# EAGLE design INA260_SFS (EAGLE 9.5.0)

## Sheet 1 of 4
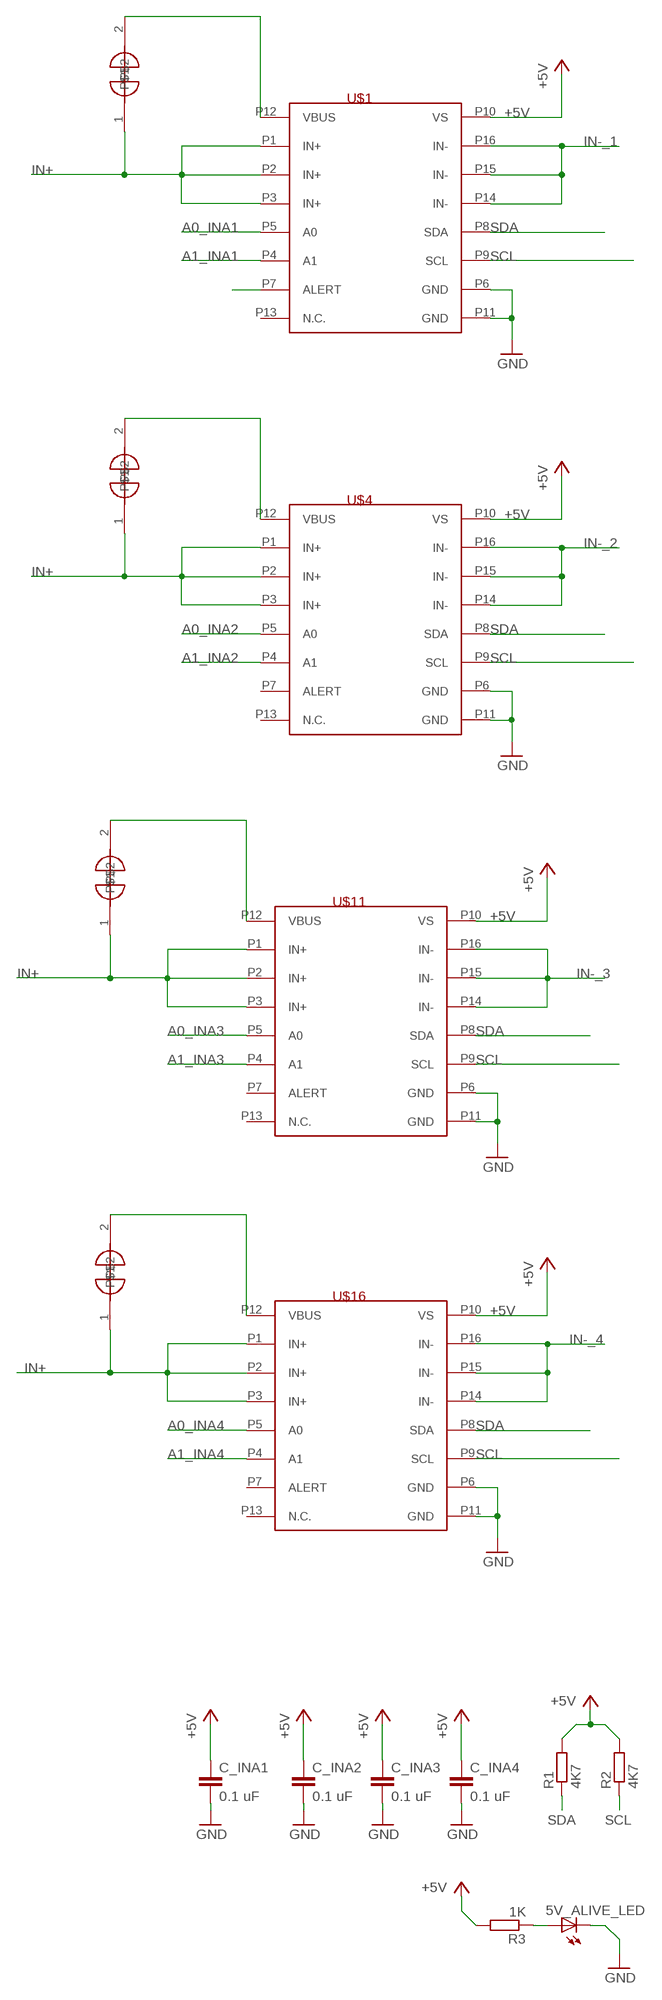
[diagram p0: schematic, sheet 1]

### Parts
5V_ALIVE_LED  LEDSMT1206  [1206]
C_INA1  0.1 uF  CAPACITOR_0805_N  [RESC0805_N]
C_INA2  0.1 uF  CAPACITOR_0805_N  [RESC0805_N]
C_INA3  0.1 uF  CAPACITOR_0805_N  [RESC0805_N]
C_INA4  0.1 uF  CAPACITOR_0805_N  [RESC0805_N]
R1  4K7  R-EU_M0805  [M0805]
R2  4K7  R-EU_M0805  [M0805]
R3  1K  R-EU_M0805  [M0805]
U$1  INA260  [TSSOP16L]
U$4  INA260  [TSSOP16L]
U$5  CLOSEDJUMPER  [SOLDERJUMPER_CLOSEDWIRE]
U$6  CLOSEDJUMPER  [SOLDERJUMPER_CLOSEDWIRE]
U$11  INA260  [TSSOP16L]
U$12  CLOSEDJUMPER  [SOLDERJUMPER_CLOSEDWIRE]
U$16  INA260  [TSSOP16L]
U$17  CLOSEDJUMPER  [SOLDERJUMPER_CLOSEDWIRE]

### Nets
+5V: C_INA1.1 C_INA2.1 C_INA3.1 C_INA4.1 R1.2 R2.2 R3.2 U$1.P10(VS) U$4.P10(VS) U$11.P10(VS) U$16.P10(VS) ; also sheet 2,4
A0_INA1: U$1.P5(A0) ; also sheet 2
A0_INA2: U$4.P5(A0) ; also sheet 2
A0_INA3: U$11.P5(A0) ; also sheet 2
A0_INA4: U$16.P5(A0) ; also sheet 2
A1_INA1: U$1.P4(A1) ; also sheet 2
A1_INA2: U$4.P4(A1) ; also sheet 2
A1_INA3: U$11.P4(A1) ; also sheet 2
A1_INA4: U$16.P4(A1) ; also sheet 2
GND: 5V_ALIVE_LED.C C_INA1.2 C_INA2.2 C_INA3.2 C_INA4.2 U$1.P6(GND) U$1.P11(GND) U$4.P6(GND) U$4.P11(GND) U$11.P6(GND) U$11.P11(GND) U$16.P6(GND) U$16.P11(GND) ; also sheet 2,3,4
IN+: U$1.P1(IN+) U$1.P2(IN+) U$1.P3(IN+) U$4.P1(IN+) U$4.P2(IN+) U$4.P3(IN+) U$5.1 U$6.1 U$11.P1(IN+) U$11.P2(IN+) U$11.P3(IN+) U$12.1 U$16.P1(IN+) U$16.P2(IN+) U$16.P3(IN+) U$17.1 ; also sheet 3,4
IN-_1: U$1.P14(IN-) U$1.P15(IN-) U$1.P16(IN-) ; also sheet 3
IN-_2: U$4.P14(IN-) U$4.P15(IN-) U$4.P16(IN-) ; also sheet 3
IN-_3: U$11.P14(IN-) U$11.P15(IN-) U$11.P16(IN-) ; also sheet 3
IN-_4: U$16.P14(IN-) U$16.P15(IN-) U$16.P16(IN-) ; also sheet 3
N$1: U$1.P12(VBUS) U$6.2
N$2: 5V_ALIVE_LED.A R3.1
N$9: U$4.P12(VBUS) U$5.2
N$11: U$1.P7(ALERT)
N$17: U$11.P12(VBUS) U$12.2
N$28: U$16.P12(VBUS) U$17.2
SCL: R2.1 U$1.P9(SCL) U$4.P9(SCL) U$11.P9(SCL) U$16.P9(SCL) ; also sheet 2,3
SDA: R1.1 U$1.P8(SDA) U$4.P8(SDA) U$11.P8(SDA) U$16.P8(SDA) ; also sheet 2,3
Unconnected: U$1.P13(N.C.) U$4.P7(ALERT) U$4.P13(N.C.) U$11.P7(ALERT) U$11.P13(N.C.) U$16.P7(ALERT) U$16.P13(N.C.)

## Sheet 2 of 4
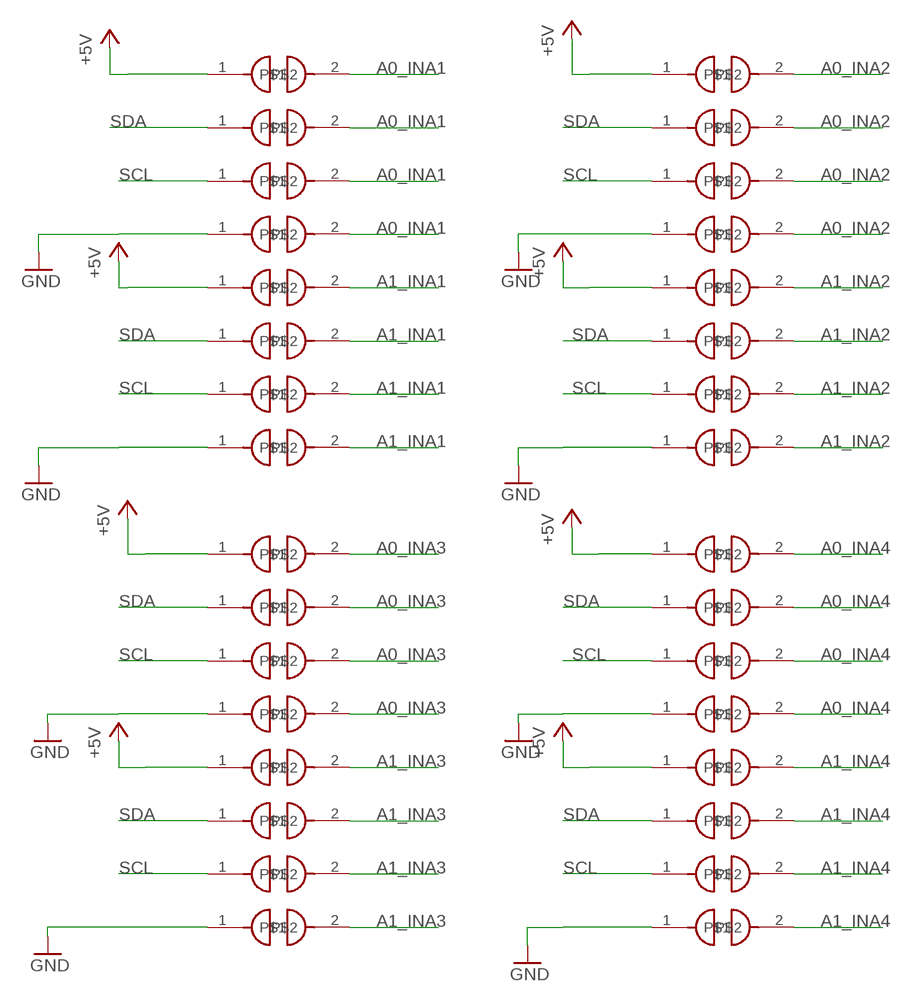
[diagram p1: schematic, sheet 2]

### Parts
U$38  JUMPER  [SOLDERJUMPER_ARROW_NOPASTE]
U$39  JUMPER  [SOLDERJUMPER_ARROW_NOPASTE]
U$40  JUMPER  [SOLDERJUMPER_ARROW_NOPASTE]
U$41  JUMPER  [SOLDERJUMPER_ARROW_NOPASTE]
U$42  JUMPER  [SOLDERJUMPER_ARROW_NOPASTE]
U$43  JUMPER  [SOLDERJUMPER_ARROW_NOPASTE]
U$44  JUMPER  [SOLDERJUMPER_ARROW_NOPASTE]
U$45  JUMPER  [SOLDERJUMPER_ARROW_NOPASTE]
U$46  JUMPER  [SOLDERJUMPER_ARROW_NOPASTE]
U$47  JUMPER  [SOLDERJUMPER_ARROW_NOPASTE]
U$48  JUMPER  [SOLDERJUMPER_ARROW_NOPASTE]
U$49  JUMPER  [SOLDERJUMPER_ARROW_NOPASTE]
U$50  JUMPER  [SOLDERJUMPER_ARROW_NOPASTE]
U$51  JUMPER  [SOLDERJUMPER_ARROW_NOPASTE]
U$52  JUMPER  [SOLDERJUMPER_ARROW_NOPASTE]
U$53  JUMPER  [SOLDERJUMPER_ARROW_NOPASTE]
U$54  JUMPER  [SOLDERJUMPER_ARROW_NOPASTE]
U$55  JUMPER  [SOLDERJUMPER_ARROW_NOPASTE]
U$56  JUMPER  [SOLDERJUMPER_ARROW_NOPASTE]
U$57  JUMPER  [SOLDERJUMPER_ARROW_NOPASTE]
U$58  JUMPER  [SOLDERJUMPER_ARROW_NOPASTE]
U$59  JUMPER  [SOLDERJUMPER_ARROW_NOPASTE]
U$60  JUMPER  [SOLDERJUMPER_ARROW_NOPASTE]
U$61  JUMPER  [SOLDERJUMPER_ARROW_NOPASTE]
U$62  JUMPER  [SOLDERJUMPER_ARROW_NOPASTE]
U$63  JUMPER  [SOLDERJUMPER_ARROW_NOPASTE]
U$64  JUMPER  [SOLDERJUMPER_ARROW_NOPASTE]
U$65  JUMPER  [SOLDERJUMPER_ARROW_NOPASTE]
U$66  JUMPER  [SOLDERJUMPER_ARROW_NOPASTE]
U$67  JUMPER  [SOLDERJUMPER_ARROW_NOPASTE]
U$68  JUMPER  [SOLDERJUMPER_ARROW_NOPASTE]
U$69  JUMPER  [SOLDERJUMPER_ARROW_NOPASTE]

### Nets
+5V: U$41.1 U$45.1 U$49.1 U$53.1 U$57.1 U$61.1 U$65.1 U$69.1 ; also sheet 1,4
A0_INA1: U$42.2 U$43.2 U$44.2 U$45.2 ; also sheet 1
A0_INA2: U$50.2 U$51.2 U$52.2 U$53.2 ; also sheet 1
A0_INA3: U$58.2 U$59.2 U$60.2 U$61.2 ; also sheet 1
A0_INA4: U$66.2 U$67.2 U$68.2 U$69.2 ; also sheet 1
A1_INA1: U$38.2 U$39.2 U$40.2 U$41.2 ; also sheet 1
A1_INA2: U$46.2 U$47.2 U$48.2 U$49.2 ; also sheet 1
A1_INA3: U$54.2 U$55.2 U$56.2 U$57.2 ; also sheet 1
A1_INA4: U$62.2 U$63.2 U$64.2 U$65.2 ; also sheet 1
GND: U$38.1 U$42.1 U$46.1 U$50.1 U$54.1 U$58.1 U$62.1 U$66.1 ; also sheet 1,3,4
SCL: U$39.1 U$43.1 U$47.1 U$51.1 U$55.1 U$59.1 U$63.1 U$67.1 ; also sheet 1,3
SDA: U$40.1 U$44.1 U$48.1 U$52.1 U$56.1 U$60.1 U$64.1 U$68.1 ; also sheet 1,3

## Sheet 3 of 4
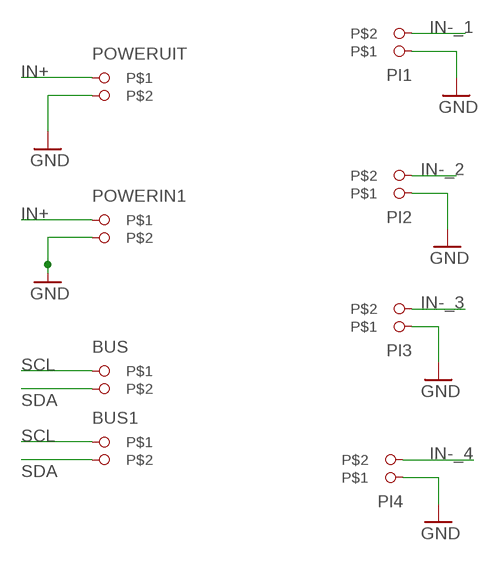
[diagram p2: schematic, sheet 3]

### Parts
BUS  CON_3.81MM2_SIDE  [CON_3.81MM2]
BUS1  CON_3.81MM2_SIDE  [CON_3.81MM2]
PI1  CON_3.81MM2_SIDE  [CON_3.81MM2]
PI2  CON_3.81MM2_SIDE  [CON_3.81MM2]
PI3  CON_3.81MM2_SIDE  [CON_3.81MM2]
PI4  CON_3.81MM2_SIDE  [CON_3.81MM2]
POWERIN1  CON_3.81MM2_SIDE  [CON_3.81MM2]
POWERUIT  CON_3.81MM2_SIDE  [CON_3.81MM2]

### Nets
GND: PI1.P$1 PI2.P$1 PI3.P$1 PI4.P$1 POWERIN1.P$2 POWERUIT.P$2 ; also sheet 1,2,4
IN+: POWERIN1.P$1 POWERUIT.P$1 ; also sheet 1,4
IN-_1: PI1.P$2 ; also sheet 1
IN-_2: PI2.P$2 ; also sheet 1
IN-_3: PI3.P$2 ; also sheet 1
IN-_4: PI4.P$2 ; also sheet 1
SCL: BUS1.P$1 BUS.P$1 ; also sheet 1,2
SDA: BUS1.P$2 BUS.P$2 ; also sheet 1,2

## Sheet 4 of 4
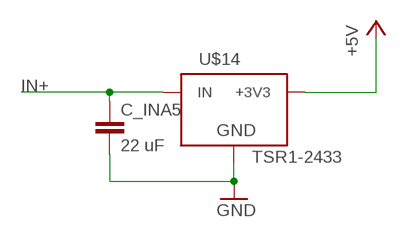
[diagram p3: schematic, sheet 4]

### Parts
C_INA5  22 uF  CAPACITOR_0805_N  [RESC0805_N]
U$14  TSR1-2433  [TSR-1]

### Nets
+5V: U$14.3(+3V3) ; also sheet 1,2
GND: C_INA5.2 U$14.2(GND) ; also sheet 1,2,3
IN+: C_INA5.1 U$14.1(IN) ; also sheet 1,3

## Library data of the parts
5V_ALIVE_LED = led:LED: LED OSRAM: - CHIPLED LG R971, LG N971, LY N971, LG Q971, LY Q971, LO R971, LY R971 LH N974, LH R974 LS Q976, LO Q976, LY Q976 LO Q996 - Hyper CHIPLED LW Q18S LB Q993, LB Q99A, LB R99A - SideLED LS A670, LO A670, LY A670, LG A670, LP A670 LB A673, LV A673, LT A673, LW A673 LH A674 LY A675 LS A676, LA A676, LO A676, LY A676, LW A676 LS A679, LY A679, LG A679 - Hyper Micro SIDELED® LS Y876, LA Y876, LO Y876, LY Y876 LT Y87S - SmartLED LW L88C, LW L88S LB L89C, LB L89S, LG L890 LS L89K, LO L89K, LY L89K LS L896, LA L896, LO L896, LY L896 - TOPLED LS T670, LO T670, LY T670, LG T670, LP T670 LSG T670, LSP T670, LSY T670, LOP T670, LYG T670 LG T671, LOG T671, LSG T671 LB T673, LV T673, LT T673, LW T673 LH T674 LS T676, LA T676, LO T676, LY T676, LB T676, LH T676, LSB T676, LW T676 LB T67C, LV T67C, LT T67C, LS T67K, LO T67K, LY T67K, LW E67C LS E67B, LA E67B, LO E67B, LY E67B, LB E67C, LV E67C, LT E67C LW T67C LS T679, LY T679, LG T679 LS T770, LO T770, LY T770, LG T770, LP T770 LB T773, LV T773, LT T773, LW T773 LH T774 LS E675, LA E675, LY E675, LS T675 LS T776, LA T776, LO T776, LY T776, LB T776 LHGB T686 LT T68C, LB T68C - Hyper Mini TOPLED® LB M676 - Mini TOPLED Santana® LG M470 LS M47K, LO M47K, LY M47K Source: http://www.osram.convergy.de LUXEON: - LUMILED® LXK2-PW12-R00, LXK2-PW12-S00, LXK2-PW14-U00, LXK2-PW14-V00 LXK2-PM12-R00, LXK2-PM12-S00, LXK2-PM14-U00 LXK2-PE12-Q00, LXK2-PE12-R00, LXK2-PE12-S00, LXK2-PE14-T00, LXK2-PE14-U00 LXK2-PB12-K00, LXK2-PB12-L00, LXK2-PB12-M00, LXK2-PB14-N00, LXK2-PB14-P00, LXK2-PB14-Q00 LXK2-PR12-L00, LXK2-PR12-M00, LXK2-PR14-Q00, LXK2-PR14-R00 LXK2-PD12-Q00, LXK2-PD12-R00, LXK2-PD12-S00 LXK2-PH12-R00, LXK2-PH12-S00 LXK2-PL12-P00, LXK2-PL12-Q00, LXK2-PL12-R00 Source: www.luxeon.com KINGBRIGHT: KA-3528ASYC Source: www.kingbright.com
BUS BUS1 PI1-PI4 POWERIN1 POWERUIT = Phoenix_connector_DJ:CON_3.81MM2_SIDE
C_INA1-C_INA5 = Nordic_misc:CAPACITOR: Generic chip capacitor
R1-R3 = rcl:R-EU_: RESISTOR, European symbol; SPICEPREFIX: R
U$1 U$4 U$11 U$16 = SFS:INA260
U$5 U$6 U$12 U$17 = SFS:CLOSEDJUMPER
U$14 = Traco power:TSR1-2433: Traco Power TSR 1-2433 3.3v switching regulator
U$38-U$69 = SFS:JUMPER

## Board
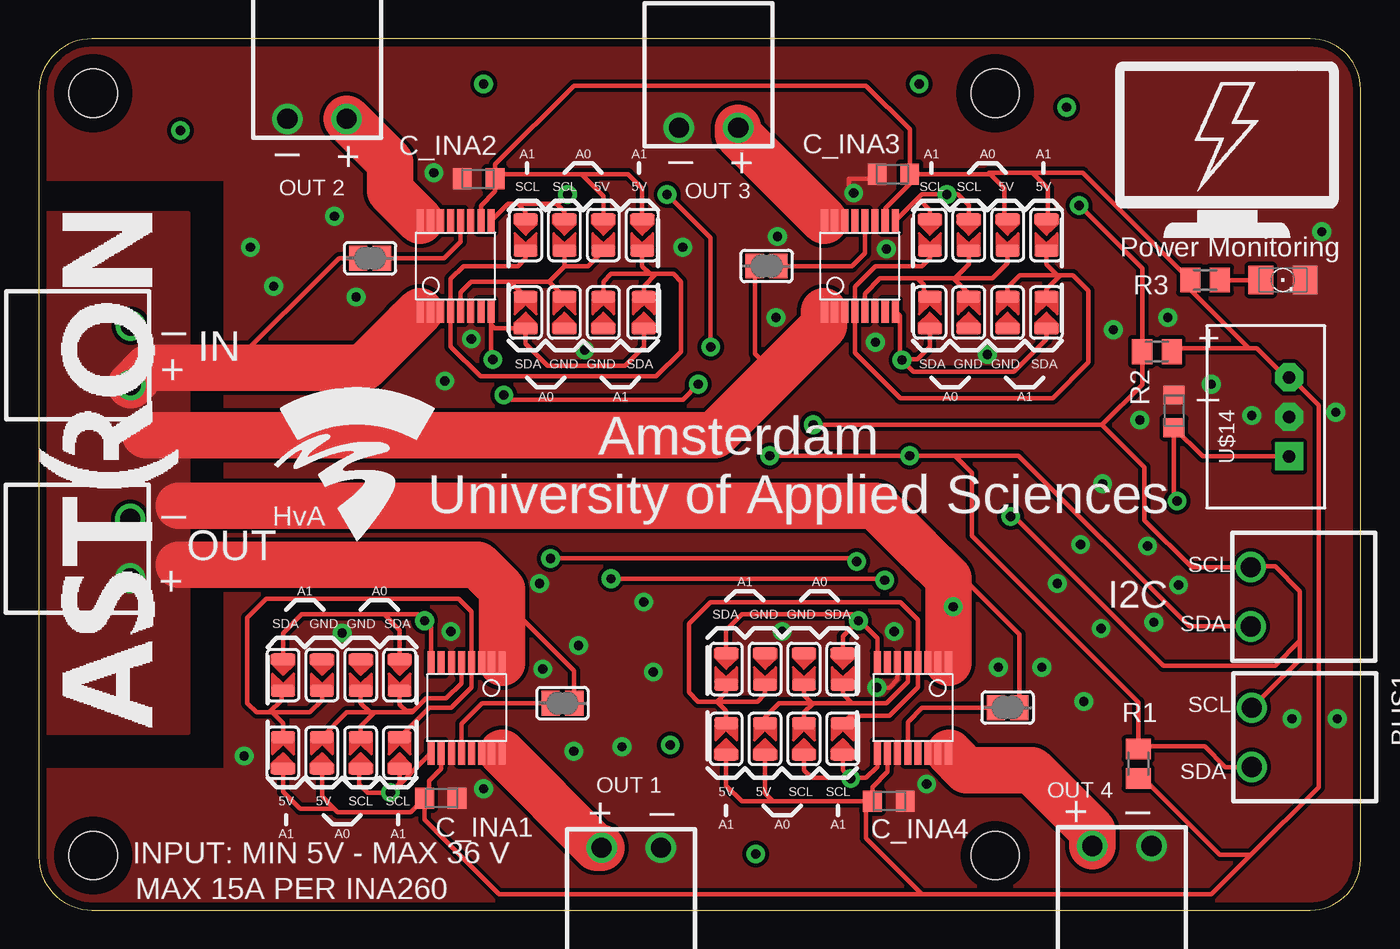
[diagram p4: board, top side]
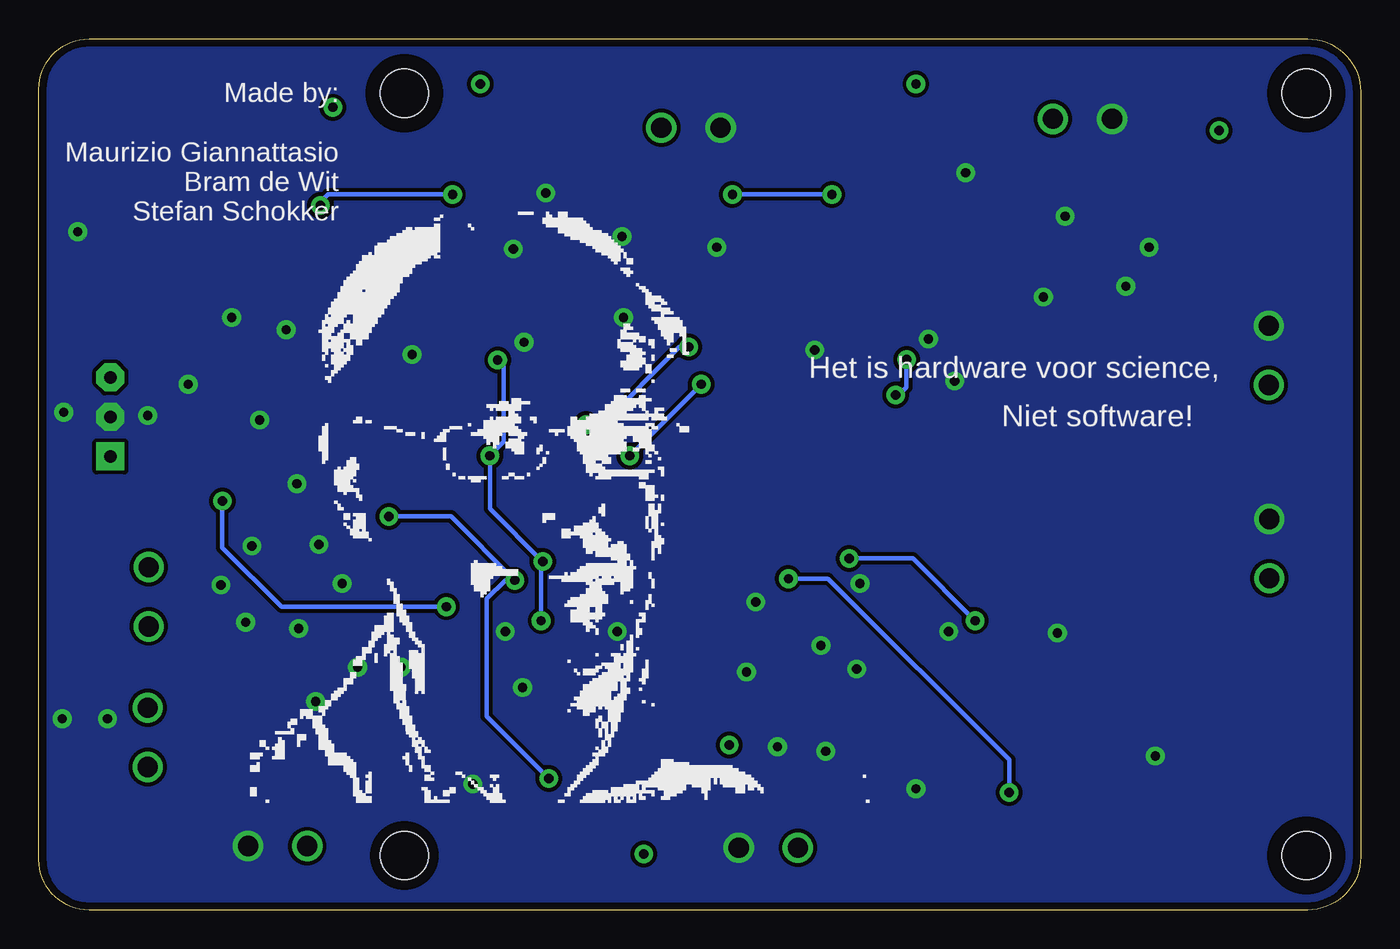
[diagram p5: board, bottom side, seen from below]

Size 85 x 56 mm. Coordinates in mm from the lower left corner, seen from the top.
Outline: 85,3.23 85,52.77 arc90 81.78,56 3.41,56 arc90 0,52.59 0,3.41 arc90 3.41,0 81.78,0 arc90 85,3.23
Copper layers (1*16): Top 0.035mm / dielectric 1.5mm / Bottom 0.035mm
Design rules "HVA-LPKF *": minimum track width 0.3mm, minimum drill 0.6mm, track to track 0.25mm, track to pad 0.25mm, pad to pad 0.25mm, via to via 0.25mm, smd to smd 0.25mm, copper to edge 0.5mm, drill to drill 0.5mm, minimum pad ring 0.3mm, minimum via ring 0.3mm, stop-mask expansion 0.1mm, vias tented up to drill 0mil, thermal gap 0.3mm
Holes 3.1 mm at 3.5,3.5 3.5,52.5 61.5,3.5 61.5,52.5
tRestrict: area 3,3 to 4,4; area 3,52 to 4,53; area 61,52 to 62,53; area 60.8,2.8 to 62.2,4.2
bRestrict: area 60.8,2.8 to 62.2,4.2; area 61,52 to 62,53; area 3,52 to 4,53; area 3,3 to 4,4

### Footprints (pad centres in the part's own frame; a part is rotated, then mirrored left to right if it is on the bottom)
1206 = smd 1.6 x 1.803: A -1.422,0; C 1.422,0
CON_3.81MM2 = drill 1.3: P$1 0,0; P$2 3.81,0
RESC0805_N = smd 1.2 x 1.35: 1 -1.1,0; 2 1,0
M0805 = smd 1.3 x 1.6: 1 -0.95,0; 2 0.95,0
TSSOP16L = smd 1.5 x 0.45: P1 -2.9,2.275; P2 -2.9,1.625; P3 -2.9,0.975; P4 -2.9,0.325; P5 -2.9,-0.325; P6 -2.9,-0.975; P7 -2.9,-1.625; P8 -2.9,-2.275; P9 2.9,-2.275; P10 2.9,-1.625; P11 2.9,-0.975; P12 2.9,-0.325; P13 2.9,0.325; P14 2.9,0.975; P15 2.9,1.625; P16 2.9,2.275
SOLDERJUMPER_CLOSEDWIRE = smd 1.168 x 1.6: 1 -0.762,0; 2 0.762,0 | smd 0.635 x 0.203: WIRE 0,0
TSR-1 = drill 0.8 pad 1.8 square: 1 -2.54,-1.5 | drill 0.8 pad 1.8 octagon: 2 0,-1.5; 3 2.54,-1.5
SOLDERJUMPER_ARROW_NOPASTE = smd 0.762 x 1.524: 1 -1.016,0; 2 1.016,0

### Placement (x,y rotation side)
5V_ALIVE_LED  80,40.5 0 top
BUS  77.94,22.04 270 top
BUS1  78,13 270 top
C_INA1  25.9,7.2 0 top
C_INA2  28.24,47 180 top
C_INA3  54.9,47.3 180 top
C_INA4  54.7,7 0 top
C_INA5  73,32.1 90 top
PI1  40,4 180 top
PI2  15.98,50.86 0 top
PI3  41.16,50.29 0 top
PI4  71.55,4.11 180 top
POWERIN1  5.91,33.75 90 top
POWERUIT  5.87,21.33 90 top
R1  70.7,9.4 270 top
R2  71.9,35.9 0 top
R3  75,40.5 180 top
U$1  27.5,13 270 top
U$2  [POWER_MONITORING_LOGO]  67.4,40.4 0 top
U$3  [JUMPER_INFO]  14.7,16.9 0 top
U$4  26.8,41.4 90 top
U$5  21.3,41.9 0 top
U$6  33.67,13.29 180 top
U$7  [JUMPER_INFO]  43,17.5 0 top
U$8  [JUMPER_INFO]  65.8,36.6 180 top
U$9  [JUMPER_INFO]  39.8,36.6 180 top
U$10  [HVA_LOGO]  14.5,22.5 0 top
U$11  52.8,41.4 90 top
U$12  46.8,41.4 0 top
U$13  [ASTRON_LOGO]  9,11.7 90 top
U$14  78.9,31.7 90 top
U$15  [ED_KLEIN]  71.5,7 0 bottom
U$16  56.2,13 270 top
U$17  62.3,13.01 180 top
U$38  18.2,15.1 270 top
U$39  23.2,10.1 90 top
U$40  15.7,15.1 270 top
U$41  15.7,10.1 90 top
U$42  20.7,15.1 270 top
U$43  20.7,10.1 90 top
U$44  23.2,15.1 270 top
U$45  18.2,10.1 90 top
U$46  36.3,38.4 90 top
U$47  31.3,43.4 270 top
U$48  38.9,38.4 90 top
U$49  38.8,43.4 270 top
U$50  33.8,38.4 90 top
U$51  33.8,43.4 270 top
U$52  31.3,38.4 90 top
U$53  36.3,43.4 270 top
U$54  62.3,38.4 90 top
U$55  57.3,43.4 270 top
U$56  64.8,38.4 90 top
U$57  64.8,43.4 270 top
U$58  59.8,38.4 90 top
U$59  59.8,43.4 270 top
U$60  57.3,38.4 90 top
U$61  62.3,43.4 270 top
U$62  46.7,15.5 270 top
U$63  51.7,11 90 top
U$64  44.2,15.5 270 top
U$65  44.2,11 90 top
U$66  49.2,15.5 270 top
U$67  49.2,11 90 top
U$68  51.7,15.5 270 top
U$69  46.7,11 90 top

### Tracks (layer width: path | path; a pad name or v marks a point on that pad's centre or on a via)
+5V
  Top 0.3: U$4.P10 28.43,45.28 29.34,46.2 C_INA2.1 | 34.9,47.3 29.64,47.3 C_INA2.1 | 34.9,47.3 36.3,45.9 U$53.1 | 34.9,47.3 37.9,47.3 38.8,46.4 U$49.1 | U$11.P10 54.42,45.12 56,46.7 C_INA3.1 | 63.9,47.4 64.9,46.4 64.9,43.8 64.8,43.9 U$57.1 | C_INA3.1 61.2,47.3 | 63.9,47.4 61.1,47.4 61.2,47.3 | U$61.1 62.1,44.62 62.1,46.4 61.2,47.3 | U$1.P10 25.88,9.07 25.1,8.3 25.1,7.5 C_INA1.1 | C_INA1.1 23.9,6.3 19.2,6.3 19,6.5 | 19,6.5 16.8,6.5 15.7,7.6 U$41.1 | U$45.1 18.2,7.3 19,6.5 | U$16.P10 54.58,8.88 53.6,7.9 53.6,7.4 | 53.6,7.4 C_INA4.1 47.2,7 | 47.2,7 45.2,7 44.2,8 U$65.1 | U$69.1 46.7,7.5 47.2,7 | 63.9,47.4 67.15,47.4 R3.2 74.05,39.88 77.82,36.12 | C_INA2.1 29.34,47.94 34.4,53 53.2,53 56,50.2 C_INA3.1 | 56.8,1 53.2,4.6 53.2,7 53.6,7.4 | 77.95,3.55 82.3,7.9 82.3,32.44 80.5,34.24 U$14.3 80.19,34.24 78.32,36.12 77.82,36.12 | 77.95,3.55 75.4,1 56.8,1 | 56.8,1 29.6,1 24.8,5.8 C_INA1.1 | 77.82,36.12 73.07,36.12 R2.2 | 77.95,3.55 75.95,3.55 71.05,8.45 R1.2
A0_INA1
  Top 0.3: U$43.2 20.7,11.8 21.6,12.7 | U$1.P5 27.18,14.57 26.2,13.6 24.9,13.6 24.1,12.8 | U$45.2 19.78,12.7 21.3,12.7 | U$42.2 20.7,13.3 21.3,12.7 | 21.3,12.7 21.6,12.7 | U$44.2 23.2,13.2 23.6,12.8 24.1,12.8 | 24.1,12.8 24,12.7 21.6,12.7
A0_INA2
  Top 0.3: U$4.P5 27.12,39.73 27.8,40.4 30.3,40.4 | 32.8,40.4 33.8,41.4 | 33.8,41.4 U$51.2 | 30.3,40.4 32.8,40.4 | U$53.2 35.32,41.4 33.8,41.4 | U$50.2 33.78,39.42 32.8,40.4 | U$52.2 31.28,39.42 30.3,40.4
A0_INA3
  Top 0.3: U$59.2 59.8,41.5 59.4,41.1 58.9,40.6 | 58.9,40.6 58.82,40.6 | 56.5,40.6 54.1,40.6 53.12,39.62 U$11.P5 | U$60.2 56.9,39.82 56.9,40.2 56.5,40.6 | U$58.2 59.8,39.62 58.82,40.6 | U$61.2 62.3,41.58 61.32,40.6 58.9,40.6 | 56.5,40.6 58.4,40.6 58.82,40.6
A0_INA4
  Top 0.3: U$16.P5 55.88,14.68 54.5,13.3 52.3,13.3 | U$69.2 46.7,12.4 47.6,13.3 49.7,13.3 | 52.3,13.3 49.8,13.3 | U$67.2 49.2,12.7 49.8,13.3 | U$66.2 49.2,13.8 49.7,13.3 | 49.7,13.3 49.8,13.3 | U$68.2 51.7,13.9 52.3,13.3
A1_INA1
  Top 0.3: U$39.2 25.08,13 26.5,13 27.82,14.32 U$1.P4 27.82,19.18 27,20 14.6,20 13.4,18.8 13.4,13.3 14,12.7 14.8,12.7 | U$38.2 18.2,13.5 17.4,12.7 15,12.7 | 15,12.7 14.8,12.7 | U$41.2 15.7,12 15,12.7 | U$40.2 15.6,13.98 15.6,13.5 14.8,12.7
A1_INA2
  Top 0.3: U$47.2 31.3,41.88 30.82,41.4 27.3,41.4 26.48,40.58 U$4.P4 26.48,36.23 28.4,34.3 39.7,34.3 41.3,35.9 41.3,40.4 40.8,40.9 39.7,40.9 | 39.3,40.9 36.8,40.9 36.3,40.4 U$46.2 | 39.3,40.9 39.7,40.9 | U$49.2 38.8,41.4 39.3,40.9 | U$48.2 38.9,40.1 39.7,40.9
A1_INA3
  Top 0.3: U$55.2 57.3,41.9 56.8,41.4 53.8,41.4 52.48,40.08 U$11.P4 52.48,35.83 55.4,32.9 65.2,32.9 67.5,35.2 67.5,39.8 66.5,40.8 65.7,40.8 | U$54.2 62.3,40 63.1,40.8 65.5,40.8 | U$56.2 64.8,39.9 65.7,40.8 | U$57.2 64.8,41.5 65.5,40.8 | 65.5,40.8 65.7,40.8
A1_INA4
  Top 0.3: U$63.2 52.18,12.5 54.7,12.5 56.52,14.32 U$16.P4 56.52,18.68 55.4,19.8 43.2,19.8 41.8,18.4 41.8,14 42.4,13.4 43.6,13.4 | U$62.2 46.7,13.9 46.2,13.4 43.6,13.4 | U$65.2 44.2,12.8 43.6,13.4 | U$64.2 44.2,14 43.6,13.4
GND  (via drill 0.6)
  Top 0.3: C_INA3.2 53.6,47 52.1,47 52.1,46.4 v52.4,46.1 | U$16.P6 55.23,14.82 54.7,14.3 v53.9,14.3
  other vias: 69.1,37.3 70.8,31.5 61,35.7 53.8,36.5 35.1,36 27.8,36.7 25.4,47.4 38.9,19.8 19.5,17.8 26.5,17.9 28.6,7.8 32.4,15.5 34.7,17 34.4,10.2 37.5,10.5 13.2,9.9 39.5,15.3 32.2,21 47.8,17.9 57.1,8.1 67.2,13.4 67,23.5 65.5,21 68.4,27.4 75.4,33.8 80.6,12.3 83.5,12.3 72.6,38.1 82.5,43.6 83.4,32 47.4,38.1 47.5,43.3 41.4,42.6 26.1,34 15.1,40.1 20.4,39.4 54.5,42.5 55,17.9 61.7,15.6 64.5,15.6 68.3,18.1 71.7,18.5 73.3,20.9 78,31.8 71.3,23.4 19,44.6 13.6,42.6
  pour Top (no thermals): 0,56.5 0,47 12,47 12,9 0,9 0,-0.5 85,-0.5 85,56.5
  pour Bottom (no thermals): 0,56.5 0,-0.5 85,-0.5 85,56.5
GND1  (via drill 0.6)
  other vias: 9.1,50.1
GND2  (via drill 0.6)
  other vias: 66.1,51.6
GND3  (via drill 0.6)
  other vias: 40.6,10.6
GND4  (via drill 0.6)
  other vias: 46.1,3.6
GND5  (via drill 0.6)
  other vias: 28.6,53.1
GND6  (via drill 0.6)
  other vias: 56.6,53.1
IN+  (via drill 0.6)
  Top 0.3: U$5.1 19.3,41.9 12.25,34.85 11.5,34.85 | U$4.P3 U$4.P2 U$4.P1 23.77,37.75 | U$6.1 34.43,15.37 31,18.8 29.77,17.57 U$1.P1 U$1.P2 U$1.P3 | U$17.1 63.06,17.74 57.6,23.2 56.6,23.2 | 47.37,34.43 46.04,35.76 U$12.1 | U$11.P3 U$11.P2 U$11.P1 50.52,37.59 50.5,37.56 | U$16.P3 U$16.P2 U$16.P1 | v58.8,19.5 58.8,21 58.48,21.32 | v73.2,26.3 73,26.5 C_INA5.1 74.84,29.16 U$14.1
  Top 3: 23.77,37.75 23.73,37.75 | POWERIN1.P$1 7.01,34.85 11.5,34.85 20.88,34.85 U$4.P1 | U$16.P1 58.48,21.32 56.6,23.2 53.8,26 9,26 | U$1.P1 29.77,20.62 28.2,22.2 9,22.2 | 6.8,30.6 6.89,30.51 43.45,30.51 47.37,34.43 50.5,37.56 50.5,38.5
  Bottom 0.3: v73.2,26.3 73.2,23.3 69.4,19.5 v58.8,19.5
  pour Top (no thermals): 0,11.4 9.6,11.4 9.6,44.8 0.2,44.8 0.2,11.6
IN-_1
  Top 0.3: U$1.P14 U$1.P15 U$1.P16
  Top 3: U$1.P16 35.88,4 PI1.P$2
IN-_2
  Top 0.3: U$4.P14 U$4.P15 U$4.P16
  Top 3: U$4.P16 22.59,46.23 22.59,48.06 PI2.P$2
IN-_3
  Top 0.3: U$11.P14 U$11.P15 U$11.P16
  Top 3: U$11.P16 44.97,49.85 PI3.P$2
IN-_4
  Top 0.3: U$16.P14 U$16.P15 U$16.P16 58.55,10.1
  Top 3: PI4.P$2 67.74,5.11 63.85,9 59.65,9 58.55,10.1
N$1
  Top 0.3: U$1.P12 27.18,11.97 28.49,13.29 U$6.2
N$2
  Top 0.3: 5V_ALIVE_LED.A R3.1
N$9
  Top 0.3: U$4.P12 27.12,42.96 26.07,41.9 U$5.2
N$17
  Top 0.3: U$11.P12 53.12,42.23 52.3,41.4 47.9,41.4 U$12.2
N$28
  Top 0.3: U$17.2 61.53,13 56.8,13 55.88,12.07 U$16.P12
SCL  (via drill 0.6)
  Top 0.3: U$4.P9 30.18,45.4 30.8,45.4 | 33.3,45.4 33.8,44.9 U$51.1 | 30.8,45.4 33.3,45.4 | 30.8,45.4 31.3,44.9 U$47.1 | U$59.1 59.8,45.3 59.1,46 v58.4,46 56.77,46 56.59,45.81 | U$55.1 57.3,45 56.59,45.71 56.59,45.81 | U$16.P9 53.92,9.22 53.2,8.5 52.2,8.5 | 52.2,8.5 49.7,8.5 49.2,9 U$67.1 | U$63.1 51.7,9 52.2,8.5 | 33.3,45.4 33.4,45.4 v34,46 | v40.4,46 43.2,43.2 v43.2,36.2 | 68.37,31.2 v49.8,31.2 | 68.37,31.2 71.1,28.47 71.1,25.07 74.13,22.04 BUS.P$1 78,22.1 79.5,22.1 81.1,20.5 81.1,17.5 81.1,17.3 | v66.9,45.3 70.95,41.25 R2.1 70.95,33.78 68.37,31.2 | U$43.1 20.7,9.45 20.6,9.35 20.6,8.1 21.15,7.55 v22.6,7.55 | v54.4,21.2 54.3,21.3 v36.8,21.3 | 52.2,8.5 v52.2,8.45 | v62.5,25.3 62.7,25.3 72.3,15.7 79.5,15.7 81.1,17.3 | U$1.P9 22.68,7.55 v22.6,7.55 | U$39.1 23.2,8.15 v22.6,7.55 | U$11.P9 56.59,45.81 | 81.1,17.3 81.1,16.1 BUS1.P$1
  Bottom 0.3: v34,46 v40.4,46 | v43.2,36.2 43.8,36.2 48.8,31.2 v49.8,31.2 | v58.4,46 66.4,46 67,45.4 v66.9,45.3 | v22.6,7.55 22.6,9.65 34.25,21.3 v36.8,21.3 | v52.2,8.45 56.2,12.45 56.2,20 55,21.2 v54.4,21.2 58.5,25.3 v62.5,25.3
SDA  (via drill 0.6)
  Top 0.3: U$11.P8 55.38,38.2 55.38,35.48 v55.5,35.35 | U$56.1 64.8,36.7 62.7,34.6 56.25,34.6 v55.5,35.35 | U$60.1 57.3,36.2 56.5,35.4 55.55,35.4 v55.5,35.35 | U$48.1 38.9,36.2 37.7,35 32.7,35 31.3,36.4 U$52.1 29.32,37.38 29.07,37.62 U$4.P8 29.07,35.52 v29.2,35.4 | U$40.1 15.7,17.8 16.9,19 22.2,19 | 22.2,19 24.4,19 v24.8,18.6 25.23,18.18 U$1.P8 | U$44.1 23.2,18 22.2,19 | U$64.1 44.2,18 45.2,19 52.4,19 52.7,18.7 | U$68.1 51.7,17.6 v52.7,18.6 52.7,18.7 | v29.91,33.11 30.2,32.81 41.41,32.81 v42.4,33.8 | v47,29.2 v56,29.2 58.9,29.2 | 58.9,29.2 63,29.2 73.97,18.23 BUS.P$2 | v32.9,22.6 52.4,22.6 v52.6,22.4 | 52.7,18.7 53.92,17.48 U$16.P8 | 58.9,29.2 60,28.1 60,24.05 70.7,13.35 R1.1 70.88,10.53 74.97,10.53 76.31,9.19 BUS1.P$2
  Bottom 0.3: v29.2,35.4 29.2,33.6 29.8,33 v29.91,33.11 | v42.4,33.8 v47,29.2 | v55.5,35.35 55.1,34.95 55.1,30.1 v56,29.2 56,25.8 v52.6,22.4 52.7,22.3 v52.7,18.6 | v24.8,18.6 28.8,22.6 v32.9,22.6

### Text on the board
tPlace: Amsterdam / University of Applied Sciences
tNames: _ | + | _ | + | OUT 2 | OUT 3 | Power Monitoring | _ | + | IN | + | _ | _ | HvA | OUT | SCL | I2C | + | SDA | SCL | SDA | _ | OUT 4 | _ | OUT 1 | + | + | INPUT: MIN 5V - MAX 36 V | MAX 15A PER INA260
bNames: Made by: / / Maurizio Giannattasio / Bram de Wit / Stefan Schokker